# EAGLE schematic LCD (EAGLE 6.4)
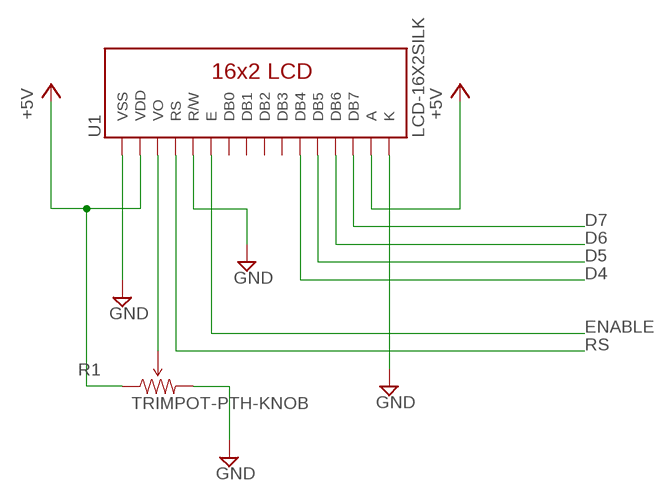
[diagram p0: schematic, sheet 1]

## Parts
R1  TRIMPOT-PTH-KNOB  [3386U]
U1  LCD-16X2SILK  [LCD-16X2]

## Nets
+5V: R1.1(CCW) U1.2(VDD) U1.15(A)
D4: U1.11(DB4)
D5: U1.12(DB5)
D6: U1.13(DB6)
D7: U1.14(DB7)
ENABLE: U1.6(E)
GND: R1.3(CW) U1.1(VSS) U1.5(R/W) U1.16(K)
N$3: R1.2(WIPER) U1.3(VO)
RS: U1.4(RS)
Unconnected: U1.7(DB0) U1.8(DB1) U1.9(DB2) U1.10(DB3)

## Library data of the parts
R1 = SparkFun-Electromechanical:TRIMPOT: Various small potentiometers for "set-and-forget" applications
U1 = SparkFun-Displays:LCD-16X2: Standard text-only 16x2 parallel input LCD